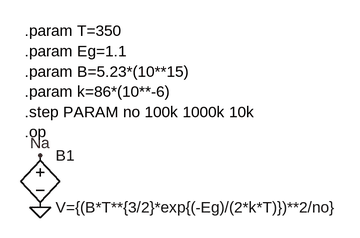
[diagram p0: schematic 3-4-a-1.asc]
3-4-a-1.asc, the LTspice schematic file:
Version 4
SHEET 1 880 680
FLAG -368 320 0
FLAG -368 240 Na
SYMBOL bv -368 224 R0
SYMATTR InstName B1
SYMATTR Value V={(B*T**{3/2}*exp{(-Eg)/(2*k*T)})**2/no}
TEXT -392 48 Left 2 !.param T=350\n.param Eg=1.1\n.param B=5.23*(10**15)\n.param k=86*(10**-6)\n.step PARAM no 100k 1000k 10k\n.op

The netlist it stands for:
* 3-4-a-1.asc
B1 Na 0 V={(B*T**{3/2}*exp{(-Eg)/(2*k*T)})**2/no}
.param T=350
.param Eg=1.1
.param B=5.23*(10**15)
.param k=86*(10**-6)
.step PARAM no 100k 1000k 10k
.op
.backanno
.end